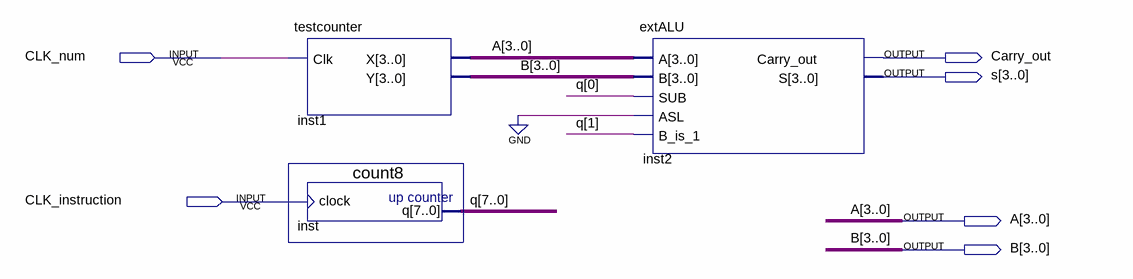
[diagram p0: schematic sheet]
// Quartus schematic alutest.bdf as structural Verilog: 3 symbols, 6 pins
module alutest (
  input  CLK_num,
  input  CLK_instruction,
  output Carry_out,
  output [3:0] s,
  output [3:0] A,
  output [3:0] B
);

  wire [7:0] q;

  testcounter inst1 (.Clk(CLK_num), .X(A), .Y(B));
  count8 inst (.clock(CLK_instruction), .q(q));
  extALU inst2 (.A(A), .B(B), .SUB(q[0]), .ASL(1'b0), .B_is_1(q[1]), .Carry_out(Carry_out), .S(s));
endmodule
